# EAGLE design leds-circle (EAGLE 6.5.0)
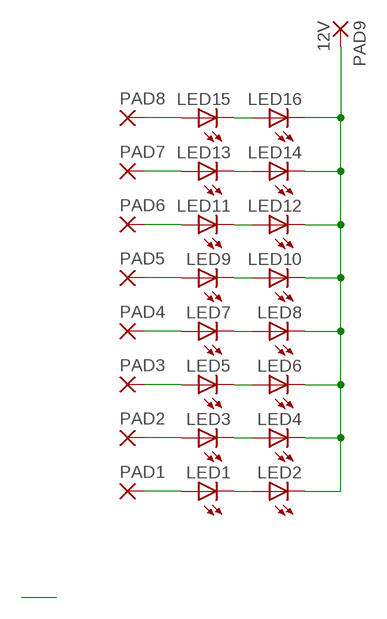
[diagram p0: schematic, sheet 1]

## Parts
LED1  LED-FKIT-1206  [FKIT-LED-1206]
LED2  LED-FKIT-1206  [FKIT-LED-1206]
LED3  LED-FKIT-1206  [FKIT-LED-1206]
LED4  LED-FKIT-1206  [FKIT-LED-1206]
LED5  LED-FKIT-1206  [FKIT-LED-1206]
LED6  LED-FKIT-1206  [FKIT-LED-1206]
LED7  LED-FKIT-1206  [FKIT-LED-1206]
LED8  LED-FKIT-1206  [FKIT-LED-1206]
LED9  LED-FKIT-1206  [FKIT-LED-1206]
LED10  LED-FKIT-1206  [FKIT-LED-1206]
LED11  LED-FKIT-1206  [FKIT-LED-1206]
LED12  LED-FKIT-1206  [FKIT-LED-1206]
LED13  LED-FKIT-1206  [FKIT-LED-1206]
LED14  LED-FKIT-1206  [FKIT-LED-1206]
LED15  LED-FKIT-1206  [FKIT-LED-1206]
LED16  LED-FKIT-1206  [FKIT-LED-1206]
PAD1  SMD2  [SMD1,27-2,54]
PAD2  SMD2  [SMD1,27-2,54]
PAD3  SMD2  [SMD1,27-2,54]
PAD4  SMD2  [SMD1,27-2,54]
PAD5  SMD2  [SMD1,27-2,54]
PAD6  SMD2  [SMD1,27-2,54]
PAD7  SMD2  [SMD1,27-2,54]
PAD8  SMD2  [SMD1,27-2,54]
PAD9  12V  SMD2  [SMD1,27-2,54]

## Nets
N$1: LED1.C LED2.A
N$2: LED3.C LED4.A
N$3: LED5.C LED6.A
N$4: LED7.C LED8.A
N$5: LED9.C LED10.A
N$6: LED11.C LED12.A
N$7: LED13.C LED14.A
N$8: LED15.C LED16.A
N$9: LED15.A PAD8.1(P)
N$10: LED13.A PAD7.1(P)
N$11: LED11.A PAD6.1(P)
N$13: LED7.A PAD4.1(P)
N$14: LED5.A PAD3.1(P)
N$15: LED3.A PAD2.1(P)
N$16: LED1.A PAD1.1(P)
N$17: LED2.C LED4.C LED6.C LED8.C LED10.C LED12.C LED14.C LED16.C PAD9.1(P)
N$22: LED9.A PAD5.1(P)

## Library data of the parts
LED1-LED16 = sparkfun-LED:LED: LEDs Standard schematic elements and footprints for 5mm, 3mm, 1206, and 0603 sized LEDs. 5mm - Spark Fun Electronics SKU : COM-00529 (and others)
PAD1-PAD9 = wirepad:SMD2: SMD PAD

## Board
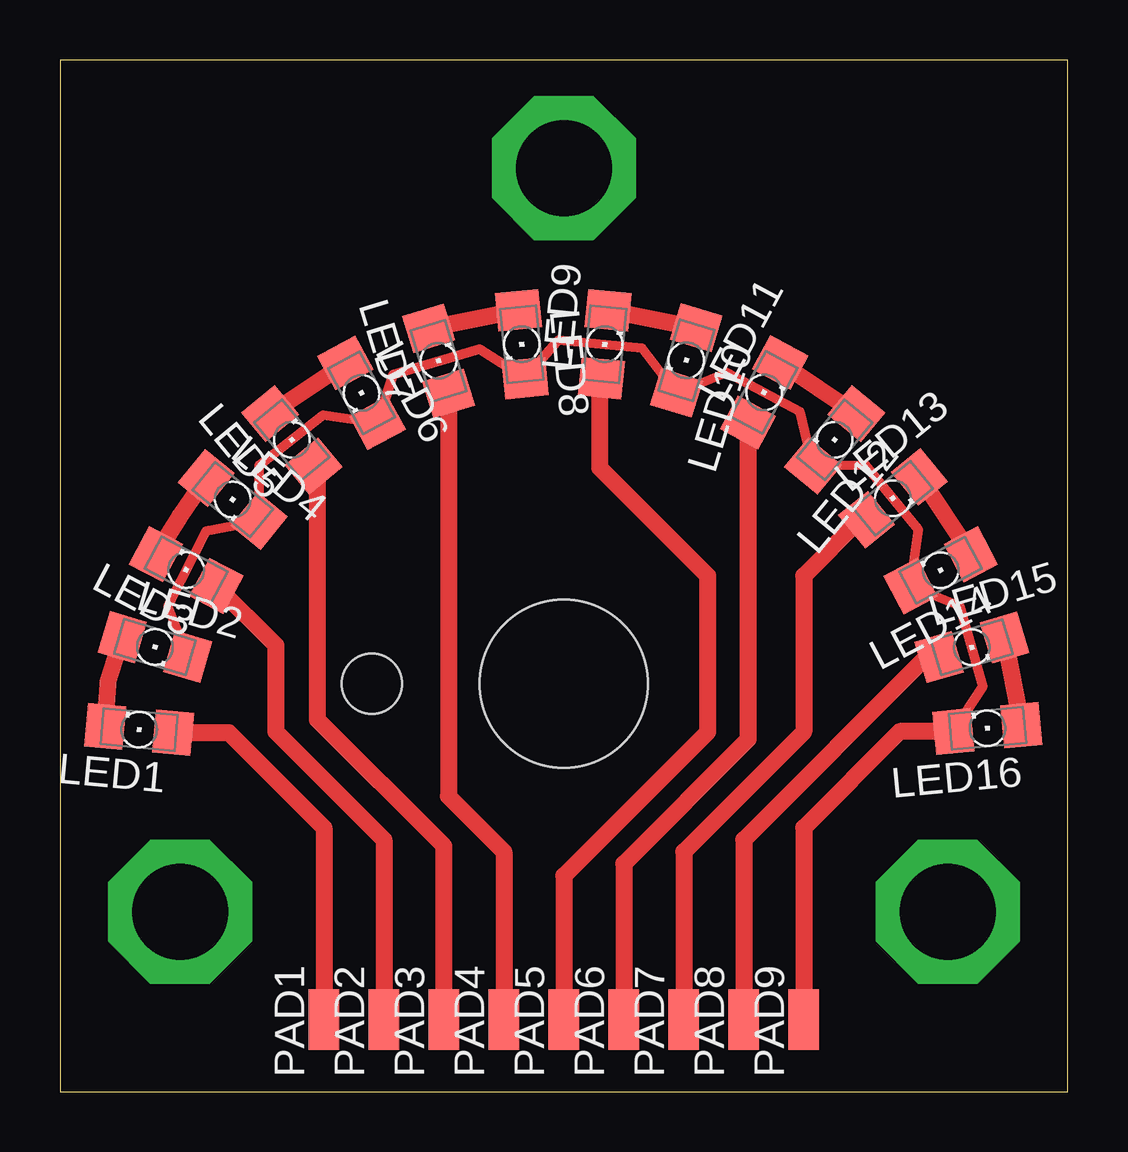
[diagram p1: board, top side]

Size 42 x 43 mm. Coordinates in mm from the lower left corner, seen from the top.
Outline: 0,0 42,0 42,43 0,43 0,0
Copper layers (1*16): Top 0.035mm / dielectric 1.5mm / Bottom 0.035mm
Design rules "default": minimum track width 10mil, minimum drill 24mil, track to track 8mil, track to pad 8mil, pad to pad 8mil, via to via 8mil, smd to smd 8mil, copper to edge 40mil, drill to drill 8mil, minimum pad ring 10mil, minimum via ring 8mil, stop-mask expansion 4mil, vias tented up to drill 0mil, thermal gap 10mil
Holes 7 mm at 21,17
Holes 2.5 mm at 13,17

### Footprints (pad centres in the part's own frame; a part is rotated, then mirrored left to right if it is on the bottom)
FKIT-LED-1206 = smd 1.6 x 1.803: A -1.422,0; C 1.422,0
SMD1,27-2,54 = smd 1.27 x 2.54: 1 0,0

### Placement (x,y rotation side)
LED1  3.3,15.09 174.8 top
LED2  3.96,18.53 343.5 top
LED3  5.26,21.74 152.2 top
LED4  7.2,24.68 320.9 top
LED5  9.67,27.17 129.6 top
LED6  12.57,29.12 298.3 top
LED7  15.78,30.46 107 top
LED8  19.25,31.15 275.7 top
LED9  22.71,31.15 84.4 top
LED10  26.11,30.48 253.1 top
LED11  29.35,29.14 61.8 top
LED12  32.29,27.17 230.5 top
LED13  34.72,24.73 39.2 top
LED14  36.71,21.73 207.9 top
LED15  38.01,18.52 16.6 top
LED16  38.66,15.14 185.3 top
PAD1  11,3 0 top
PAD2  13.5,3 0 top
PAD3  16,3 0 top
PAD4  18.5,3 0 top
PAD5  21,3 0 top
PAD6  23.5,3 0 top
PAD7  26,3 0 top
PAD8  28.5,3 0 top
PAD9  31,3 0 top

### Tracks (layer width: path | path; a pad name or v marks a point on that pad's centre or on a via)
N$1
  Top 0.7: LED1.C 2,17 2.01,17.09 LED2.A
N$2
  Top 0.7: LED3.C 5,24 LED4.A
N$3
  Top 0.7: LED5.C LED6.A
N$4
  Top 0.7: LED7.C LED8.A
N$5
  Top 0.7: LED9.C LED10.A
N$6
  Top 0.7: LED11.C LED12.A
N$7
  Top 0.7: LED13.C LED14.A
N$8
  Top 0.7: LED15.C LED16.A
N$9
  Top 0.7: LED15.A 36.11,18.11 28.5,10.5 PAD8.1
N$10
  Top 0.7: LED13.A 33.33,23.83 31,21.5 31,15 26,10 PAD7.1
N$11
  Top 0.7: LED11.A 28.68,14.68 23.5,9.5 PAD6.1
N$13
  Top 0.7: LED7.A 16.2,12.3 18.5,10 PAD4.1
N$14
  Top 0.7: PAD3.1 16,10.23 10.73,15.5 10.73,25.92 LED5.A
N$15
  Top 0.7: 6.92,21.08 LED3.A 9,18.59 9,15 13.5,10.5 PAD2.1
N$16
  Top 0.7: LED1.A 7.04,14.96 11,11 PAD1.1
N$17
  Top 0.4: LED2.C 4.52,20.2 4.5,20.26 6.1,23.37 LED4.C 8.31,26.12 8.31,26.09 10.96,28.19 LED6.C 13.89,29.88 17.49,30.95 LED8.C 20.72,31.26 20.75,31.29 20.78,31.33 24.27,30.99 LED10.C 27.81,29.96 30.85,28.34 LED12.C 33.52,26.12 33.57,26.12 35.79,23.42 LED14.C 37.51,20.24 38.47,16.88 LED16.C
  Top 0.7: LED16.C 35.01,15.01 31,11 PAD9.1
N$18  (via drill 4 pad 6)
  other vias: 5,7.5
N$19  (via drill 4 pad 6)
  other vias: 37,7.5
N$20  (via drill 4 pad 6)
  other vias: 21,38.5
N$22
  Top 0.7: PAD5.1 21,9 27,15 27,21.5 22.5,26 22.5,29.66 LED9.A 22.59,29.73